# Altium schematic sheet 0_Overview.SchDoc: Overview
size A3; DocumentNumber: 1; SheetNumber: 1; SheetTotal: 6; PageSetup: Record=PageOptions|CenterHorizontal=True|CenterVertical=True|PrintScale=1.01|XCorrection=1.00|YCorrection=1.00|PrintKind=0|BorderSize=5000000|LeftOffset=0|BottomOffset=0|Orientation=2|PaperLength=1000|PaperWidth=1000|Scale=100|PaperSource=7|PrintQuality=-4|MediaType=1|DitherType=10|PaperKind=A3|PrintScaleMode=1
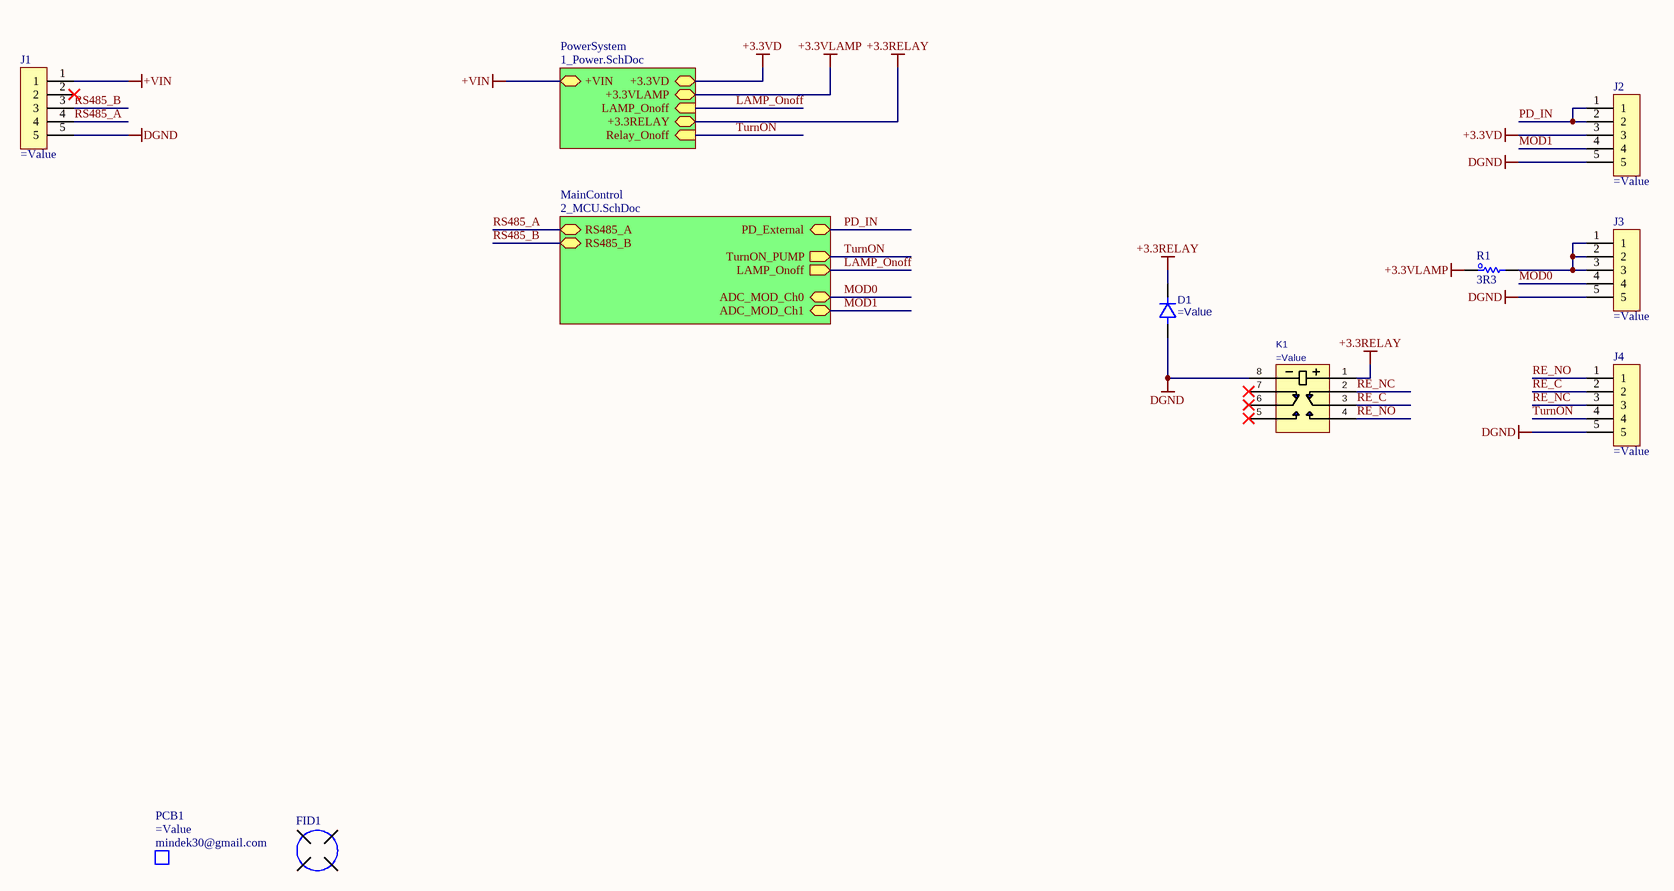
[diagram p0: 0_Overview.SchDoc]

## Parts
D1  (no value)  [SOD323]
FID1  FIDUCIAL  [FID]  (value not drawn)  (no BOM)
J1  (no value)  [MOLEX_532610571]
J2  (no value)  [MOLEX_532610571]
J3  (no value)  [MOLEX_532610571]
J4  (no value)  [MOLEX_532610571]
K1  (no value)  [RELAY_HFD4/12-SR]
PCB1  Manufacturer: mindek30@gmail.com  (mechanical)
R1  3R3  [R_2512]

## Sub-sheets
MainControl = 2_MCU.SchDoc: RS485_A (bidir), RS485_B (bidir), LAMP_Onoff (out), TurnON_PUMP (out), ADC_MOD_Ch0 (bidir), ADC_MOD_Ch1 (bidir), PD_External (bidir)
PowerSystem = 1_Power.SchDoc: +3.3VD (bidir), +VIN (bidir), +3.3VLAMP (bidir), LAMP_Onoff (in), Relay_Onoff (in), +3.3RELAY (bidir)

## Nets
+3.3RELAY: D1.1 K1.1 ; sheet PowerSystem/+3.3RELAY
+3.3VD: J2.3 ; sheet PowerSystem/+3.3VD
+3.3VLAMP: R1.1 ; sheet PowerSystem/+3.3VLAMP
+VIN: J1.1 ; sheet PowerSystem/+VIN
DGND: D1.2 J1.5 J2.5 J3.5 J4.5 K1.8
LAMP_Onoff: sheet MainControl/LAMP_Onoff, sheet PowerSystem/LAMP_Onoff
MOD0: J3.4 ; sheet MainControl/ADC_MOD_Ch0
MOD1: J2.4 ; sheet MainControl/ADC_MOD_Ch1
PD_IN: J2.1 J2.2 ; sheet MainControl/PD_External
RE_C: J4.2 K1.3
RE_NC: J4.3 K1.2
RE_NO: J4.1 K1.4
RS485_A: J1.4 ; sheet MainControl/RS485_A
RS485_B: J1.3 ; sheet MainControl/RS485_B
TurnON: J4.4 ; sheet MainControl/TurnON_PUMP, sheet PowerSystem/Relay_Onoff
NetJ3_1: J3.1 J3.2 J3.3 R1.2

Not connected (* = marked no-connect by the designer): J1 2*; K1 5* 6* 7*

## Notes on the sheet
- Title :
- Revision :
- ผู้จัดทำ:
- Size:
- A3
- Time:
- ผู้เขียน:
- บริษัท ยูนิเวอร์แซล ยูทีลิตี้ส์ จำกัด (มหาชน) เลขที่ 1 อาคาร อีสท์วอเตอร์ ชั้น 18 ซอยวิภาวดีรังสิต 5 แขวงจอมพล เขตจตุจักร กรุงเทพฯ 10900
  Tel : +662-272-1688
  Fax :+662-2721690-1
- -
- Sheet:
- of
- ผู้อำนวยการ
- ผู้ตรวจสอบ:
- Number:
- กรรมการผู้จัดการ:
- File:

## Library data of the parts
D1 = D_PW_SD103AWS: DIODE SCHOTTKY 40V 2A 0603; Manufacturer: Slkor(SLKORMICRO Elec.); Value: SD103AWS; PackageReference: SOD-323; PartID: C513472; PartNumber: SD103AWS
FID1 = FID_FIDUCIAL: Manufacturer: mindek30@gmail.com; Value2: Non SE; Value: Non SE; PartNumber: =PCB_PN+'_'+PCB_Rev; PartID: =PCB_Rev; PackageReference: Non SE; Value3: Non SE
J1-J4 = CON_5P_532610571: CONN HEADER SMD R/A 5POS 1.25MM; PartNumber: 0532610571; Manufacturer: Molex; Value: 0532610571; Value2: AFC12-S05DCC-00; PartID: WM7623CT-ND; PackageReference: 5P; Value3: *
K1 = SW_RELAY_HFD4/12-SR: Telecom Non Latching 3VDC DPDT SMD Relays RoHS; Manufacturer: Xiamen Hongfa Electroacoustic; Value: HFD4/3-S1R; PackageReference: *; PartID: C143232; PartNumber: HFD4/3-S1R
PCB1 = PCB_Bare: BARE PCB; PartNumber: =PCB_PN+'_'+PCB_Rev; PackageReference: Non SE; PartID: =PCB_Rev; Value2: =JobFile_Title; Value: =PartNumber; Value3: =PCBA_PN+'_'+PCBA_Rev
R1 = R_Resister: RES SMD 3.3 OHM 5% 3W 2512; Manufacturer: Vishay; PartNumber: 35223R3JT; Value: 3R3; PackageReference: 2512; PartID: A121247CT-ND; Value2: 3W; Value3: 5%